# EAGLE design midipal-v01 (EAGLE 5.10)
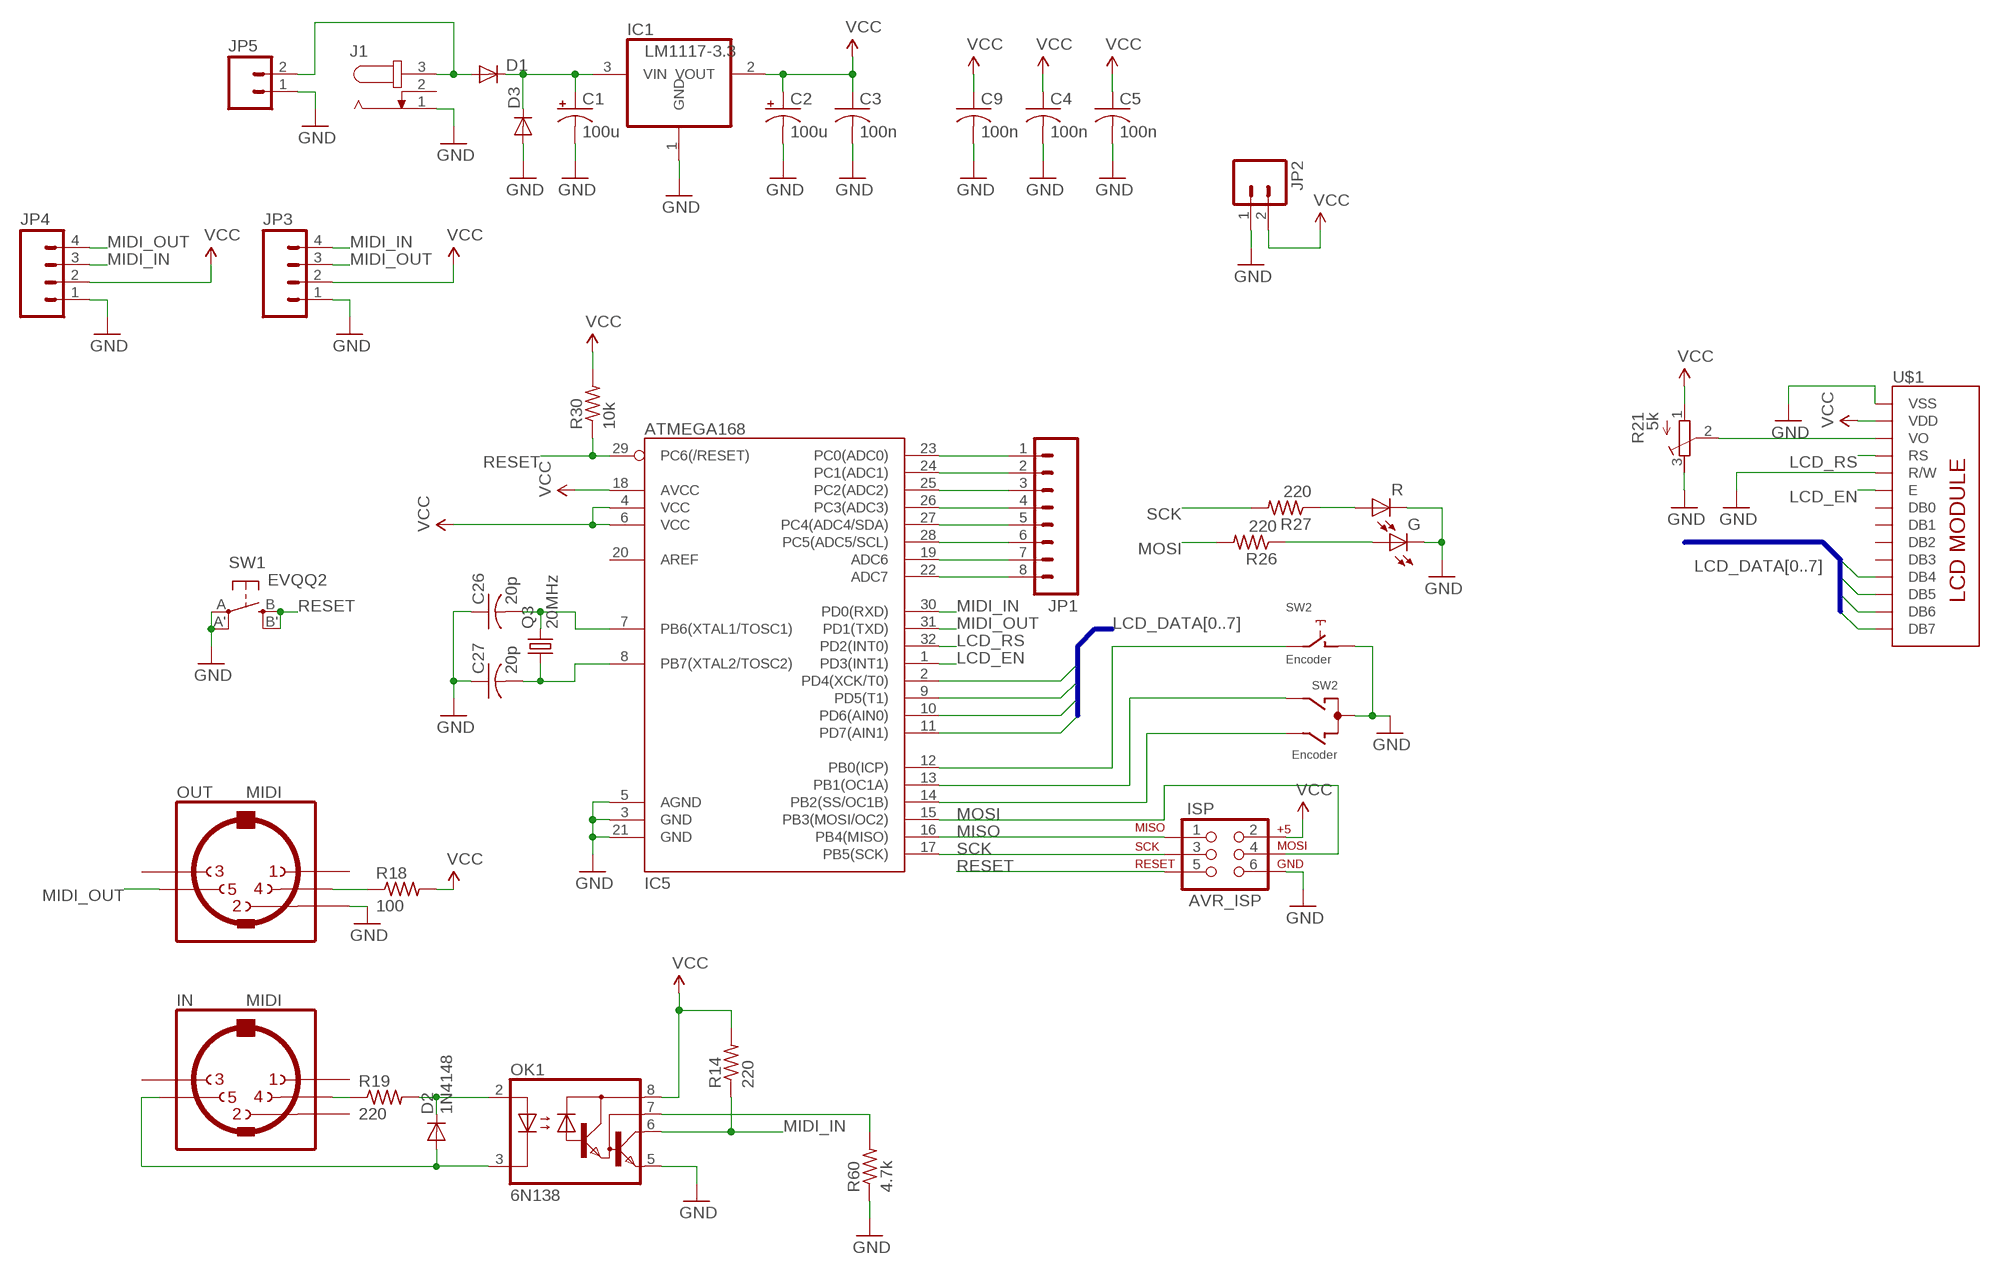
[diagram p0: schematic, sheet 1]

## Parts
C1  100u  CPOL-USD  [PANASONIC_D]
C2  100u  CPOL-USD  [PANASONIC_D]
C3  100n  C-USC0805  [C0805]
C4  100n  C-USC0805  [C0805]
C5  100n  C-USC0805  [C0805]
C9  100n  C-USC0805  [C0805]
C26  20p  C-USC0805  [C0805]
C27  20p  C-USC0805  [C0805]
D1  DIODESMB  [SMB-DIODE]
D2  1N4148  DIODE-SOD323-W  [SOD323-W]
D3  DIODESMB  [SMB-DIODE]
G  LEDCHIPLED_1206  [CHIPLED_1206]
IC1  LM1117-3.3  REG1117  [SOT223]
IC5  ATMEGA168  [TQFP32-08]
IN  MIDI  MAB5SH  [MAB5SH]
ISP  AVR_ISP  AVR_SPI_PRG_6PTH  [2X3]
J1  JACK-PLUG2  [SPC4078_BIG_HOLES]
JP1  M08  [1X08]
JP2  M02PTH  [1X02]
JP3  M04PTH  [1X04]
JP4  M04PTH  [1X04]
JP5  M02  [1X02_LONGPADS]
OK1  6N138  6N138SMD8  [DIL8-SMD]
OUT  MIDI  MAB5SH  [MAB5SH]
Q3  20MHz  CRYSTALHC49UP  [HC49UP]
R  LEDCHIPLED_1206  [CHIPLED_1206]
R14  220  R-US_R0805  [R0805]
R18  100  R-US_R0805  [R0805]
R19  220  R-US_M0805  [M0805]
R21  5k  R-TRIMM3296P  [RTRIM3296P]
R26  220  R-US_R0805  [R0805]
R27  220  R-US_R0805  [R0805]
R30  10k  R-US_R0805  [R0805]
R60  4.7k  R-US_M0805  [M0805]
SW1  EVQQ2  [EVQ-Q2]
SW2  Encoder  EC12E_SW  [ALPS_EC12E_SW]
U$1  LCD_MODULE_NO_BKL  [LCD_MODULE_1X8]

## Nets
GND: C1.- C2.- C3.2 C4.2 C5.2 C9.2 C26.1 C27.1 D3.A G.C IC1.1(GND) IC5.3(GND) IC5.5(AGND) IC5.21(GND) ISP.6 J1.1 JP2.1 JP3.1 JP4.1 JP5.1 OK1.5(GND) OUT.2 R21.3(A) R60.1 R.C SW1.A'(P1) SW1.A(P) SW2.C SW2.D U$1.1(VSS) U$1.5(R/W)
LCD_DATA4: IC5.2(PD4(XCK/T0)) U$1.11(DB4)
LCD_DATA5: IC5.9(PD5(T1)) U$1.12(DB5)
LCD_DATA6: IC5.10(PD6(AIN0)) U$1.13(DB6)
LCD_DATA7: IC5.11(PD7(AIN1)) U$1.14(DB7)
LCD_EN: IC5.1(PD3(INT1)) U$1.6(E)
LCD_RS: IC5.32(PD2(INT0)) U$1.4(RS)
MIDI_IN: IC5.30(PD0(RXD)) JP3.4 JP4.3 OK1.6(VO) R14.1
MIDI_OUT: IC5.31(PD1(TXD)) JP3.3 JP4.4 OUT.5
MISO: IC5.16(PB4(MISO)) ISP.1
MOSI: IC5.15(PB3(MOSI/OC2)) ISP.4 R26.2
N$2: C1.+ D1.C D3.C IC1.3(VIN)
N$3: IC5.23(PC0(ADC0)) JP1.1
N$5: IC5.24(PC1(ADC1)) JP1.2
N$6: IC5.25(PC2(ADC2)) JP1.3
N$7: IC5.26(PC3(ADC3)) JP1.4
N$8: IC5.27(PC4(ADC4/SDA)) JP1.5
N$9: IC5.28(PC5(ADC5/SCL)) JP1.6
N$10: IC5.19(ADC6) JP1.7
N$11: IC5.22(ADC7) JP1.8
N$12: G.A R26.1
N$13: OK1.7(VB) R60.2
N$14: R27.1 R.A
N$15: IC5.14(PB2(SS/OC1B)) SW2.B
N$16: IC5.13(PB1(OC1A)) SW2.A
N$17: IC5.12(PB0(ICP)) SW2.E
N$18: R21.2(S) U$1.3(VO)
N$28: D2.C OK1.2(A) R19.2
N$68: OUT.4 R18.1
N$72: IN.4 R19.1
N$73: D2.A IN.5 OK1.3(C)
N$82: C27.2 IC5.8(PB7(XTAL2/TOSC2)) Q3.1
N$83: C26.2 IC5.7(PB6(XTAL1/TOSC1)) Q3.2
RESET: IC5.29(PC6(/RESET)) ISP.5 R30.1 SW1.B'(S1) SW1.B(S)
SCK: IC5.17(PB5(SCK)) ISP.3 R27.2
VCC: C2.+ C3.1 C4.1 C5.1 C9.1 IC1.2(VOUT) IC5.4(VCC) IC5.6(VCC) IC5.18(AVCC) ISP.2 JP2.2 JP3.2 JP4.2 OK1.8(VCC) R14.2 R18.2 R21.1(E) R30.2 U$1.2(VDD)
VIN: D1.A J1.3 JP5.2
Unconnected: IC5.20(AREF) IN.1 IN.2 IN.3 J1.2 OUT.1 OUT.3 SW2.GND1(G) SW2.GND2(G) U$1.7(DB0) U$1.8(DB1) U$1.9(DB2) U$1.10(DB3)

## Buses
LCD_DATA[0..7]

## Library data of the parts
C1 C2 = rcl:CPOL-US: POLARIZED CAPACITOR, American symbol
C3-C5 C9 C26 C27 = rcl:C-US: CAPACITOR, American symbol
D1 D3 = SparkFun:DIODE: Diode These are standard reverse protection diodes and small signal diodes. SMA package can handle up to about 1A. SOD-323 can handle about 200mA. What the SOD-323 package when ordering, there are some mfgs out there that are 5-pin packages.
D2 = diode:DIODE-: DIODE
G R = led:LED: LED OSRAM: - CHIPLED LG R971, LG N971, LY N971, LG Q971, LY Q971, LO R971, LY R971 LH N974, LH R974 LS Q976, LO Q976, LY Q976 LO Q996 - Hyper CHIPLED LW Q18S LB Q993, LB Q99A, LB R99A - SideLED LS A670, LO A670, LY A670, LG A670, LP A670 LB A673, LV A673, LT A673, LW A673 LH A674 LY A675 LS A676, LA A676, LO A676, LY A676, LW A676 LS A679, LY A679, LG A679 - Hyper Micro SIDELED® LS Y876, LA Y876, LO Y876, LY Y876 LT Y87S - SmartLED LW L88C, LW L88S LB L89C, LB L89S, LG L890 LS L89K, LO L89K, LY L89K LS L896, LA L896, LO L896, LY L896 - TOPLED LS T670, LO T670, LY T670, LG T670, LP T670 LSG T670, LSP T670, LSY T670, LOP T670, LYG T670 LG T671, LOG T671, LSG T671 LB T673, LV T673, LT T673, LW T673 LH T674 LS T676, LA T676, LO T676, LY T676, LB T676, LH T676, LSB T676, LW T676 LB T67C, LV T67C, LT T67C, LS T67K, LO T67K, LY T67K, LW E67C LS E67B, LA E67B, LO E67B, LY E67B, LB E67C, LV E67C, LT E67C LW T67C LS T679, LY T679, LG T679 LS T770, LO T770, LY T770, LG T770, LP T770 LB T773, LV T773, LT T773, LW T773 LH T774 LS E675, LA E675, LY E675, LS T675 LS T776, LA T776, LO T776, LY T776, LB T776 LHGB T686 LT T68C, LB T68C - Hyper Mini TOPLED® LB M676 - Mini TOPLED Santana® LG M470 LS M47K, LO M47K, LY M47K Source: http://www.osram.convergy.de LUXEON: - LUMILED® LXK2-PW12-R00, LXK2-PW12-S00, LXK2-PW14-U00, LXK2-PW14-V00 LXK2-PM12-R00, LXK2-PM12-S00, LXK2-PM14-U00 LXK2-PE12-Q00, LXK2-PE12-R00, LXK2-PE12-S00, LXK2-PE14-T00, LXK2-PE14-U00 LXK2-PB12-K00, LXK2-PB12-L00, LXK2-PB12-M00, LXK2-PB14-N00, LXK2-PB14-P00, LXK2-PB14-Q00 LXK2-PR12-L00, LXK2-PR12-M00, LXK2-PR14-Q00, LXK2-PR14-R00 LXK2-PD12-Q00, LXK2-PD12-R00, LXK2-PD12-S00 LXK2-PH12-R00, LXK2-PH12-S00 LXK2-PL12-P00, LXK2-PL12-Q00, LXK2-PL12-R00 Source: www.luxeon.com KINGBRIGHT: KA-3528ASYC Source: www.kingbright.com
IC1 = burr-brown:REG1117: 800mA and 1A Low Dropout (LDO) Positive Regulator 1.8V, 2.5V, 2.85V, 3.3V, 5V, and Adj
IC5 = SparkFun:ATMEGA168
IN OUT = og-midi:MAB5SH: Female CONNECTOR 5 pins 90 deg. with shield, horizontal (DIN 41524)
ISP = SparkFun:AVR_SPI_PRG_6: AVR ISP 6 Pin This is the reduced ISP connector for AVR programming. Common on Arduino. This footprint will take up less PCB space and can be used with a 10-pin to 6-pin adapter such as SKU: BOB-08508
J1 = con-jack2:JACK-PLUG: DC POWER JACK Power Jack, DC, Right Angle, Through Hole, Rated 5A at 16VDC, PC Terminals Distributor: Farnell (www.Farnell.de) Drawing: 84N1161.pdf / 84N1162.pdf Manufacturer: SPC Technology (www.spctechnology.com) Type: SPC4077 / SPC 4078
JP1 = SparkFun:M08: Header 8 Standard 8-pin 0.1" header. Use with straight break away headers (SKU : PRT-00116), right angle break away headers (PRT-00553), swiss pins (PRT-00743), machine pins (PRT-00117), and female headers (PRT-00115).
JP2 JP5 = SparkFun:M02: Header 2 Standard 2-pin 0.1" header. Use with straight break away headers (SKU : PRT-00116), right angle break away headers (PRT-00553), swiss pins (PRT-00743), machine pins (PRT-00117), and female headers (PRT-00115). Molex polarized connector foot print use with SKU : PRT-08233 with associated crimp pins and housings.
JP3 JP4 = SparkFun:M04: Header 4 Standard 4-pin 0.1" header. Use with straight break away headers (SKU : PRT-00116), right angle break away headers (PRT-00553), swiss pins (PRT-00743), machine pins (PRT-00117), and female headers (PRT-00115). Molex polarized connector foot print use with SKU : PRT-08231 with associated crimp pins and housings.
OK1 = og-optocouplers:6N138: MOTOROLA OPTO COUPLER
Q3 = crystal:CRYSTAL: CRYSTAL
R14 R18 R19 R26 R27 R30 R60 = rcl:R-US_: RESISTOR, American symbol
R21 = rcl:R-TRIMM: Trimm resistor
SW1 = adafruit:EVQQ2: SMT 6mm switch, EVQQ2 series http://www.ladyada.net/library/eagle
SW2 = switch-alps:EC12E_SW: ALPS rotary Encoder EC12E series with switch
U$1 = og-lcd:LCD_MODULE_NO_BKL

## Board
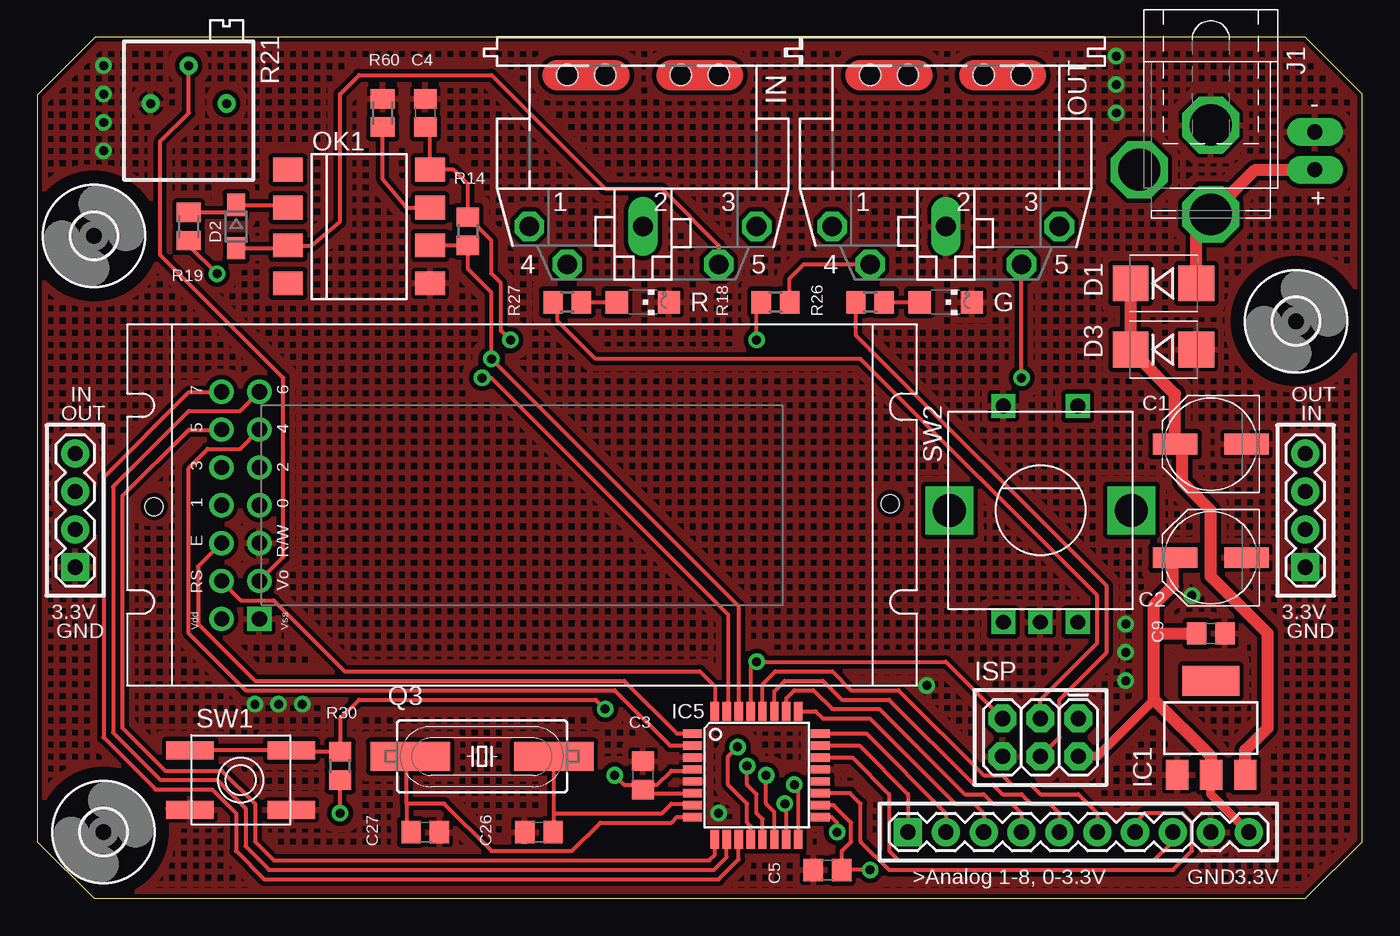
[diagram p1: board, top side]
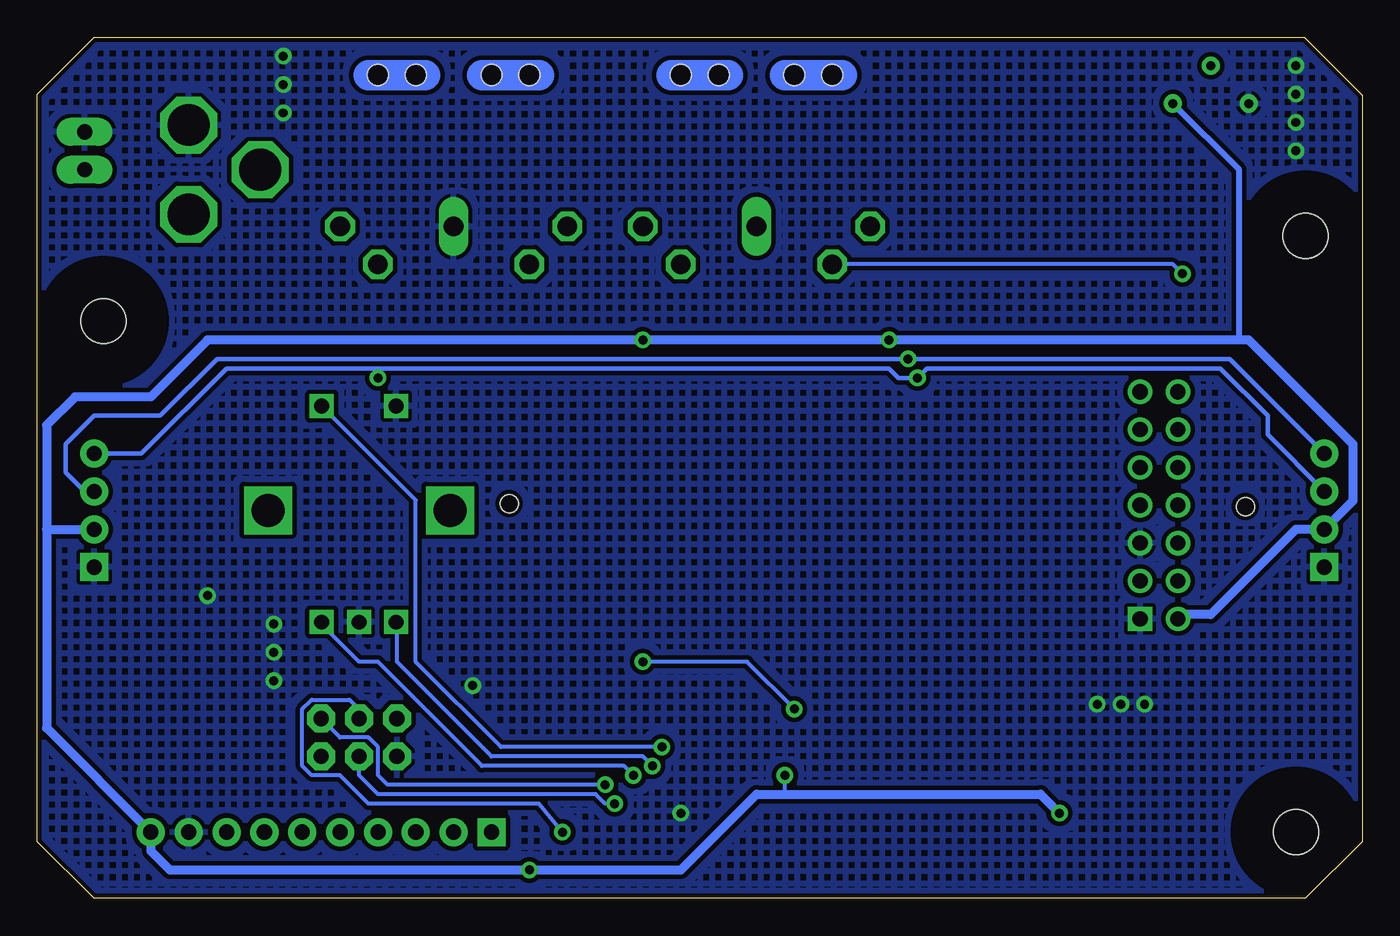
[diagram p2: board, bottom side, seen from below]

Size 88.9 x 57.79 mm. Coordinates in mm from the lower left corner, seen from the top.
Outline: 88.9,53.98 85.09,57.79 3.89,57.79 0,53.9 0,3.81 3.81,0 85.09,0 88.9,3.81 88.9,53.98
Copper layers (1*16): Top 0.035mm / dielectric 1.5mm / Bottom 0.035mm
Design rules "SparkFun": minimum track width 8mil, minimum drill 20mil, track to track 8mil, track to pad 8mil, pad to pad 8mil, via to via 8mil, smd to smd 8mil, copper to edge 10mil, drill to drill 8mil, minimum pad ring 12mil, minimum via ring 10mil, stop-mask expansion 4mil, vias tented up to drill 25mil, thermal gap 10mil

### Footprints (pad centres in the part's own frame; a part is rotated, then mirrored left to right if it is on the bottom)
PANASONIC_D = smd 3 x 1.4: + 2.4,0; - -2.4,0
C0805 = smd 1.3 x 1.5: 1 -0.95,0; 2 0.95,0
SMB-DIODE = smd 2.4 x 2.4: A 2.2,0; C -2.2,0
SOD323-W = smd 1.5 x 1.2: A 1.45,0; C -1.45,0
CHIPLED_1206 = smd 1.5 x 1.5: A 0,-1.75; C 0,1.75
SOT223 = smd 1.499 x 2.007: 1 -2.261,-3.15; 2 0.025,-3.15; 3 2.311,-3.15 | smd 3.81 x 2.007: 4 0,3.15
TQFP32-08 = smd 1.27 x 0.559: 1 -4.293,2.8; 2 -4.293,2; 3 -4.293,1.2; 4 -4.293,0.4; 5 -4.293,-0.4; 6 -4.293,-1.2; 7 -4.293,-2; 8 -4.293,-2.8; 17 4.293,-2.8; 18 4.293,-2; 19 4.293,-1.2; 20 4.293,-0.4; 21 4.293,0.4; 22 4.293,1.2; 23 4.293,2; 24 4.293,2.8 | smd 0.559 x 1.27: 9 -2.8,-4.293; 10 -2,-4.293; 11 -1.2,-4.293; 12 -0.4,-4.293; 13 0.4,-4.293; 14 1.2,-4.293; 15 2,-4.293; 16 2.8,-4.293; 25 2.8,4.293; 26 2,4.293; 27 1.2,4.293; 28 0.4,4.293; 29 -0.4,4.293; 30 -1.2,4.293; 31 -2,4.293; 32 -2.8,4.293
MAB5SH = drill 1.321 octagon: 1 7.62,7.62; 3 -7.62,7.62; 4 5.08,10.16; 5 -5.08,10.16 | drill 1.321 long: 2 0,7.62 | hole 1.4: 2.54,-2.54; -2.54,-2.54; -5.08,-2.54; 5.08,-2.54
2X3 = drill 1.016 pad 1.88 octagon: 1 0,0; 2 0,2.54; 3 2.54,0; 4 2.54,2.54; 5 5.08,0; 6 5.08,2.54
SPC4078_BIG_HOLES = drill 2.8 pad 3.81 octagon: 1 -0.46,0; 2 2.54,-4.8; 3 5.54,0
1X08 = drill 1.016 pad 1.88 square: 1 0,0 | drill 1.016 pad 1.88 round: 2 2.54,0; 3 5.08,0; 4 7.62,0; 5 10.16,0; 6 12.7,0; 7 15.24,0; 8 17.78,0
1X02 = drill 1.016 pad 1.88 round: 1 0,0; 2 2.54,0
1X04 = drill 1.016 pad 1.88 square: 1 0,0 | drill 1.016 pad 1.88 round: 2 2.54,0; 3 5.08,0; 4 7.62,0
1X02_LONGPADS = drill 1.016 pad 1.88 long: 1 0,0; 2 2.54,0
DIL8-SMD = smd 1.6 x 2: 1 -3.81,-4.77; 2 -1.27,-4.77; 3 1.27,-4.77; 4 3.81,-4.77; 5 3.81,4.77; 6 1.27,4.77; 7 -1.27,4.77; 8 -3.81,4.77
HC49UP = smd 5.334 x 1.93: 1 -4.826,0; 2 4.826,0
R0805 = smd 1.3 x 1.5: 1 -0.95,0; 2 0.95,0
M0805 = smd 1.3 x 1.6: 1 -0.95,0; 2 0.95,0
RTRIM3296P = drill 0.61 round: 1 0,-2.54; 2 2.54,0; 3 0,2.54
EVQ-Q2 = smd 3.2 x 1.2: A -3.4,-2; A' 3.4,-2; B -3.4,2; B' 3.4,2
ALPS_EC12E_SW = drill 1 square: A -2.5,-7.5; B 2.5,-7.5; C 0,-7.5; D -2.5,7; E 2.5,7 | drill 2.2 square: GND1 -6.1,0; GND2 6.1,0
LCD_MODULE_1X8 = drill 1.016 square: 1 8.87,4.47 | drill 1.016 round: 2 6.33,4.47; 3 8.87,7.01; 4 6.33,7.01; 5 8.87,9.55; 6 6.33,9.55; 7 8.87,12.09; 8 6.33,12.09; 9 8.87,14.63; 10 6.33,14.63; 11 8.87,17.17; 12 6.33,17.17; 13 8.87,19.71; 14 6.33,19.71 | hole 1.2: 1.8,12; 51.2,12.2
3,0 = hole 3: 0,0

### Placement (x,y rotation side)
C1  78.74,30.48 180 top
C2  78.74,22.86 180 top
C3  40.64,8.26 90 top
C4  26.04,52.71 90 top
C5  53.02,1.91 180 top
C9  78.74,17.78 0 top
C26  33.66,4.45 0 top
C27  26.04,4.45 180 top
D1  75.56,41.27 0 top
D2  13.34,45.09 270 top
D3  75.56,36.83 0 top
G  60.96,40.01 270 top
IC1  78.74,11.43 0 top
IC5  48.26,8.26 0 top
IN  40.64,52.71 180 top
ISP  69.85,12.06 180 top
J1  78.74,51.44 270 top
JP1  58.42,4.45 0 top
JP2  78.74,4.45 0 top
JP3  2.54,22.22 90 top
JP4  85.09,22.22 90 top
JP5  85.72,51.44 270 top
OK1  21.59,45.09 270 top
OUT  60.96,52.71 180 top
Q3  29.85,9.53 0 top
R  40.64,40.01 270 top
R14  28.89,44.77 90 top
R18  49.53,40.01 180 top
R19  10.16,45.09 90 top
R21  10.16,53.34 90 top
R26  55.88,40.01 180 top
R27  35.56,40.01 180 top
R30  20.32,8.89 270 top
R60  23.18,52.71 270 top
SW1  13.65,7.94 0 top
SW2  67.31,26.04 0 top
U$1  6.03,14.29 0 top
U$2  [3,0]  84.46,38.73 0 top
U$3  [3,0]  4.45,4.45 0 top
U$4  [3,0]  3.81,44.45 0 top

### Tracks (layer width: path | path; a pad name or v marks a point on that pad's centre or on a via)
GND  (via drill 0.6)
  other vias: 77.47,20.32 45.72,5.71 59.69,14.29 73.03,18.41 73.03,16.51 73.03,14.61 4.45,55.88 4.45,53.98 4.45,52.07 4.45,50.16 72.39,56.52 72.39,54.61 72.39,52.71 14.61,13.02 16.19,13.02 17.78,13.02
  pour Top (isolate 0.305, hatched): -1.27,59.05 -1.27,-0.64 90.17,-0.64 90.17,59.05
  pour Bottom (isolate 0.305, hatched): -1.27,-0.64 90.17,-0.64 90.17,59.05 -1.27,59.05
LCD_DATA4
  Top 0.254: U$1.11 13.61,30.16 11.43,30.16 10.16,28.89 10.16,17.78 13.97,13.97 38.73,13.97 42.45,10.26 IC5.2
LCD_DATA5
  Top 0.254: U$1.12 12.34,31.43 10.16,31.43 5.72,26.99 5.72,11.43 8.57,8.57 12.38,8.57 14.61,6.35 14.61,3.81 15.88,2.54 45.09,2.54 45.46,2.92 IC5.9
LCD_DATA6
  Top 0.254: U$1.13 13.61,32.7 10.16,32.7 5.08,27.62 5.08,11.11 8.26,7.94 12.07,7.94 13.97,6.03 13.97,3.49 15.56,1.91 45.4,1.91 46.26,2.76 IC5.10
LCD_DATA7
  Top 0.254: U$1.14 11.7,33.97 10.16,33.97 4.45,28.26 4.45,10.79 7.94,7.3 11.75,7.3 13.34,5.71 13.34,3.17 15.24,1.27 45.72,1.27 47.06,2.61 IC5.11
LCD_EN
  Top 0.254: U$1.6 10.8,22.27 10.8,18.41 14.61,14.61 39.37,14.61 42.92,11.05 IC5.1
LCD_RS
  Top 0.254: U$1.4 13.66,20 15.88,20 20.64,15.24 44.45,15.24 45.46,14.23 IC5.32
MIDI_IN  (via drill 0.6)
  Top 0.254: OK1.6 R14.1 | R14.1 | IC5.30 47.06,19.61 v30.48,36.2 30.48,40.64 28.89,42.23 R14.1
  Bottom 0.305: JP3.4 8.89,36.2 v30.48,36.2 76.84,36.2 80.65,32.39 85.09,32.39 87,30.48 87,28.57 85.72,27.3 JP4.3
MIDI_OUT  (via drill 0.6)
  Top 0.254: IC5.31 46.36,12.64 46.36,19.05 30.48,34.93 v29.85,34.93 | v66.04,34.93 OUT.5
  Bottom 0.254: 66.04,35.56 v66.04,34.93
  Bottom 0.305: JP3.3 6.35,31.11 6.35,32.39 9.53,35.56 29.21,35.56 v29.85,34.93 31.12,34.93 31.75,35.56 66.04,35.56 76.2,35.56 81.92,29.84 JP4.4
MISO  (via drill 0.6)
  Top 0.254: v50.8,7.62 51.06,7.36 IC5.16
  Bottom 0.254: ISP.1 68.58,10.79 66.68,10.79 66.04,10.16 66.04,8.26 65.41,7.62 v50.8,7.62
MOSI  (via drill 0.6)
  Top 0.254: ISP.4 68.58,10.79 68.58,13.34 71.75,16.51 71.75,20.95 54.93,37.78 R26.2 | v50.17,6.35 50.26,6.25 IC5.15
  Bottom 0.254: ISP.4 67.31,8.26 66.04,6.99 51.44,6.99 50.8,6.35 v50.17,6.35
N$2
  Top 0.813: IC1.3 81.05,9.93 82.55,11.43 82.55,17.78 78.74,21.59 78.74,26.04 76.84,27.94 76.84,29.98 C1.+ 76.34,33.86 D3.C D1.C
N$3
  Top 0.254: JP1.1 58.42,6.99 55.15,10.26 IC5.23
N$5
  Top 0.254: JP1.2 60.96,5.71 55.62,11.05 IC5.24
N$6
  Top 0.254: JP1.3 63.5,5.71 62.87,6.35 61.59,6.35 55.88,12.06 52.7,12.06 52.22,12.55 IC5.25
N$7
  Top 0.254: JP1.4 66.04,5.71 65.41,6.35 64.14,6.35 63.5,6.99 62.23,6.99 56.52,12.7 53.34,12.7 52.07,13.97 50.8,13.97 50.26,13.43 IC5.26
N$8
  Top 0.254: JP1.5 68.58,5.71 67.94,6.35 66.68,6.35 66.04,6.99 64.77,6.99 64.14,7.62 62.87,7.62 57.15,13.34 53.98,13.34 52.7,14.61 50.17,14.61 49.46,13.9 IC5.27
N$9
  Top 0.254: JP1.6 71.12,5.71 69.85,6.99 67.31,6.99 66.68,7.62 65.41,7.62 64.77,8.26 63.5,8.26 57.79,13.97 54.61,13.97 53.34,15.24 49.53,15.24 48.66,14.37 IC5.28
N$10
  Top 0.254: JP1.7 73.66,5.08 74.3,5.71 76.84,5.71 77.47,5.08 77.47,3.17 76.2,1.91 57.15,1.91 55.25,3.81 55.25,6.35 54.54,7.06 IC5.19
N$11
  Top 0.254: JP1.8 76.2,3.81 74.93,2.54 57.79,2.54 57.15,3.17 57.15,6.99 54.68,9.46 IC5.22
N$12
  Top 0.254: R26.1 G.A
N$13
  Top 0.254: R60.2 23.18,48.26 24.77,46.36 OK1.7
N$14
  Top 0.254: R27.1 R.A
N$15  (via drill 0.6)
  Top 0.254: v48.9,8.26 48.9,6.35 49.46,5.79 IC5.14
  Bottom 0.254: SW2.B 69.85,18.57 69.85,18.41 67.31,15.88 66.04,15.88 59.06,8.89 49.53,8.89 v48.9,8.26
N$16  (via drill 0.6)
  Top 0.254: v47.62,8.89 47.62,7.62 48.26,6.99 48.26,5.71 48.66,5.32 IC5.13
  Bottom 0.254: SW2.A 64.77,17.86 64.77,15.88 58.42,9.53 48.26,9.53 v47.62,8.89
N$17  (via drill 0.6)
  Top 0.254: v46.99,10.16 46.36,9.53 46.36,7.62 47.62,6.35 47.62,5.08 47.86,4.85 IC5.12
  Bottom 0.254: SW2.E 63.5,26.72 63.5,15.88 57.79,10.16 v46.99,10.16
N$18
  Top 0.254: U$1.3 16.51,22.9 16.51,34.93 8.26,43.18 8.26,50.8 10.16,52.71 R21.2
N$28
  Top 0.254: OK1.2 16.64,46.54 D2.C 12.84,46.04 R19.2
N$68
  Top 0.254: OUT.4 51.44,42.55 50.48,41.59 R18.1
N$72  (via drill 0.6)
  Top 0.254: v12.07,41.91 10.16,43.82 R19.1
  Bottom 0.254: v12.07,41.91 12.7,42.55 IN.4
N$73
  Top 0.254: D2.A 16.64,43.64 OK1.3 18.42,43.82 20.32,45.41 20.32,53.98 21.59,55.25 30.48,55.25 38.1,47.62 41.91,47.62 45.72,43.82 IN.5
N$82
  Top 0.254: Q3.1 25.09,9.46 24.77,9.14 24.77,6.35 | 24.77,6.35 27.31,6.35 30.48,3.17 35.88,3.17 37.78,5.08 42.55,5.08 42.92,5.46 IC5.8 | 24.77,6.35 24.77,5.08 25.09,4.76 C27.2
N$83
  Top 0.254: C26.2 34.67,4.51 34.67,5.71 | 34.67,5.71 Q3.2 | IC5.7 43.87,6.35 42.55,6.35 41.91,5.71 34.67,5.71
RESET  (via drill 0.6)
  Top 0.254: SW1.B SW1.B' 15.88,9.84 R30.1 20.32,12.06 21.59,13.34 37.47,13.34 v38.1,12.7 | ISP.5 60.96,15.88 v48.26,15.88 47.86,15.47 IC5.29
  Bottom 0.254: v38.1,12.7 41.28,15.88 v48.26,15.88
SCK  (via drill 0.6)
  Top 0.254: R27.2 34.93,39.69 34.93,38.73 37.47,36.2 55.25,36.2 71.12,20.32 71.12,17.14 67.31,13.34 ISP.3 | v53.66,4.45 53.66,5.08 53.28,5.46 IC5.17
  Bottom 0.254: ISP.3 67.31,12.7 67.94,13.34 70.49,13.34 71.12,12.7 71.12,8.89 70.49,8.26 68.58,8.26 66.68,6.35 55.25,6.35 v53.66,4.45
VCC  (via drill 0.6)
  Top 0.254: C4.1 26.36,51.76 OK1.8 27.94,48.9 28.89,47.94 R14.2 30.48,44.13 30.48,41.91 31.12,41.27 31.12,38.1 v31.75,37.47 | R18.2 48.26,39.69 v48.26,37.47 | C3.1 40.89,7.06 IC5.6 | IC5.4 43.89,8.57 42.55,8.57 41.59,7.62 40.96,7.62 C3.1 | C3.1 40.33,7.62 39.37,7.62 v38.73,8.26 | v20.32,5.71 R30.2 | IC5.18 53.44,6.25 54.61,5.08 54.61,3.81 53.98,3.17 C5.1 v55.88,1.91
  Top 0.61: 78.74,8.26 78.74,6.99 JP2.2 | 74.93,13.34 71.12,9.53 ISP.2
  Top 0.813: C2.+ 76.2,22.72 76.2,20.95 74.93,19.68 74.93,17.78 | 74.93,17.78 74.93,13.34 78.77,9.5 IC1.2 78.74,8.26 | 74.93,17.78 C9.1
  Bottom 0.254: 38.73,6.99 v38.73,8.26
  Bottom 0.406: R21.1 8.26,48.9 8.26,37.47
  Bottom 0.61: U$1.2 12.07,19.05 10.16,19.05 4.45,24.76 JP3.2 0.64,26.67 0.64,30.48 7.62,37.47 8.26,37.47 v31.75,37.47 v48.26,37.47 77.47,37.47 81.28,33.66 86.36,33.66 88.27,31.75 88.27,24.76 | 88.27,24.76 88.27,11.43 JP2.2 81.28,3.17 80.01,1.91 v55.88,1.91 45.72,1.91 40.64,6.99 38.73,6.99 21.59,6.99 v20.32,5.71 | 88.27,24.76 JP4.2
VIN
  Top 0.813: D1.A 77.77,44.92 J1.3 81.74,48.9 JP5.2

### Text on the board
tNames: - | + | IN | OUT | OUT | IN | 3.3V | 3.3V | GND | GND | >Analog 1-8, 0-3.3V | GND | 3.3V